# Altium schematic sheet snesslot.SchDoc: SD2SNES
size C; DrawnBy: Gargan; Revision: I; SheetNumber: 2; SheetTotal: 6
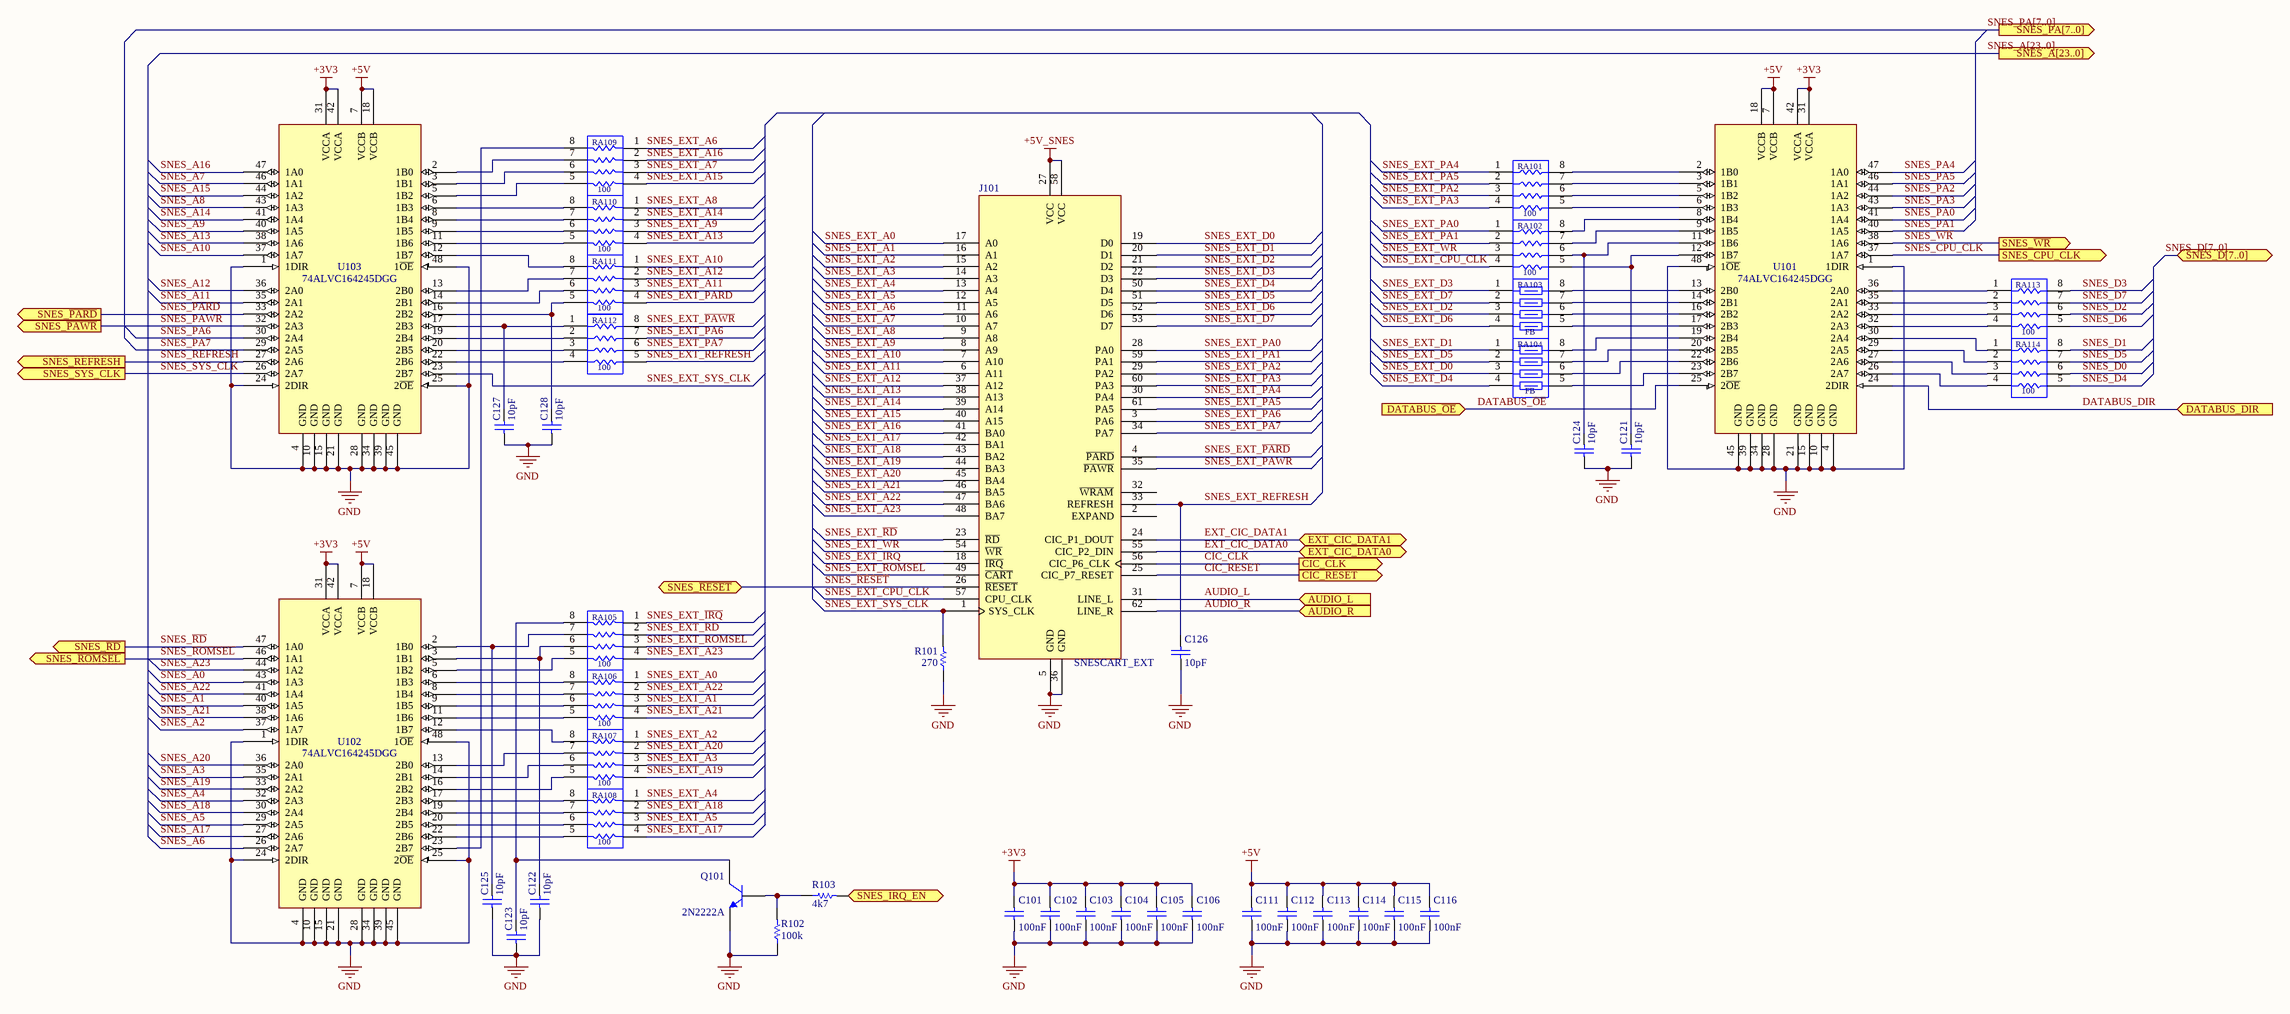
[diagram p0: snesslot.SchDoc]

## Parts
C101  100nF  [SM0805]
C102  100nF  [SM0805]
C103  100nF  [SM0805]
C104  100nF  [SM0805]
C105  100nF  [SM0805]
C106  100nF  [SM0805]
C111  100nF  [SM0805]
C112  100nF  [SM0805]
C113  100nF  [SM0805]
C114  100nF  [SM0805]
C115  100nF  [SM0805]
C116  100nF  [SM0805]
C121  10pF  [SM0805]
C122  10pF  [SM0805]
C123  10pF  [SM0805]
C124  10pF  [SM0805]
C125  10pF  [SM0805]
C126  10pF  [SM0805]
C127  10pF  [SM0805]
C128  10pF  [SM0805]
J101  SNESCART_EXT  [SNESCART_EDGE_CONN]
Q101  2N2222A  [SOT23EBC]
R101  270  [SM0805]
R102  100k  [SM0805]
R103  4k7  [SM0805]
RA101  100  [R_PACK_1206_2]
RA102  100  [R_PACK_1206_2]
RA103  FB  [R_PACK_1206_2]
RA104  FB  [R_PACK_1206_2]
RA105  100  [R_PACK_1206_2]
RA106  100  [R_PACK_1206_2]
RA107  100  [R_PACK_1206_2]
RA108  100  [R_PACK_1206_2]
RA109  100  [R_PACK_1206_2]
RA110  100  [R_PACK_1206_2]
RA111  100  [R_PACK_1206_2]
RA112  100  [R_PACK_1206_2]
RA113  100  [R_PACK_1206_2]
RA114  100  [R_PACK_1206_2]
U101  74ALVC164245DGG  [TSSOP48]
U102  74ALVC164245DGG  [TSSOP48]
U103  74ALVC164245DGG  [TSSOP48]

## Ports
AUDIO_L (in), AUDIO_R (in), CIC_CLK (out), CIC_RESET (out), DATABUS_DIR (in), DATABUS_~{OE} (in), EXT_CIC_DATA0 (bidir), EXT_CIC_DATA1 (bidir), SNES_A[23..0] (out), SNES_CPU_CLK (out), SNES_D[7..0] (bidir), SNES_IRQ_EN (in), SNES_PA[7..0] (out), SNES_REFRESH (out), SNES_SYS_CLK (out), SNES_~{PARD} (out), SNES_~{PAWR} (out), SNES_~{RD} (out), SNES_~{RESET} (bidir), SNES_~{ROMSEL} (out), SNES_~{WR} (out)

## Nets
+3V3: C101.2 C102.2 C103.2 C104.2 C105.2 C106.2 U101.31(VCCA) U101.42(VCCA) U102.31(VCCA) U102.42(VCCA) U103.31(VCCA) U103.42(VCCA)
+5V: C111.2 C112.2 C113.2 C114.2 C115.2 C116.2 U101.7(VCCB) U101.18(VCCB) U102.7(VCCB) U102.18(VCCB) U103.7(VCCB) U103.18(VCCB)
+5V_SNES: J101.27(VCC) J101.58(VCC)
GND: C101.1 C102.1 C103.1 C104.1 C105.1 C106.1 C111.1 C112.1 C113.1 C114.1 C115.1 C116.1 C121.1 C122.1 C123.1 C124.1 C125.1 C126.2 C127.1 C128.1 J101.5(GND) J101.36(GND) Q101.2(E) R101.1 R102.1 U101.1(1DIR) U101.4(GND) U101.10(GND) U101.15(GND) U101.21(GND) U101.28(GND) U101.34(GND) U101.39(GND) U101.45(GND) U101.48(1~{OE}) U102.1(1DIR) U102.4(GND) U102.10(GND) U102.15(GND) U102.21(GND) U102.24(2DIR) U102.25(2~{OE}) U102.28(GND) U102.34(GND) U102.39(GND) U102.45(GND) U102.48(1~{OE}) U103.1(1DIR) U103.4(GND) U103.10(GND) U103.15(GND) U103.21(GND) U103.24(2DIR) U103.25(2~{OE}) U103.28(GND) U103.34(GND) U103.39(GND) U103.45(GND) U103.48(1~{OE})
AUDIO_L: J101.31(LINE_L) ; port AUDIO_L
AUDIO_R: J101.62(LINE_R) ; port AUDIO_R
CIC_CLK: J101.56(CIC_P6_CLK) ; port CIC_CLK
CIC_RESET: J101.25(CIC_P7_RESET) ; port CIC_RESET
DATABUS_DIR: U101.24(2DIR) ; port DATABUS_DIR
DATABUS_~{OE}: U101.25(2~{OE}) ; port DATABUS_~{OE}
EXT_CIC_DATA0: J101.55(CIC_P2_DIN) ; port EXT_CIC_DATA0
EXT_CIC_DATA1: J101.24(CIC_P1_DOUT) ; port EXT_CIC_DATA1
SNES_A0: U102.43(1A3)
SNES_A1: U102.40(1A5)
SNES_A2: U102.37(1A7)
SNES_A3: U102.35(2A1)
SNES_A4: U102.32(2A3)
SNES_A5: U102.29(2A5)
SNES_A6: U102.26(2A7)
SNES_A7: U103.46(1A1)
SNES_A8: U103.43(1A3)
SNES_A9: U103.40(1A5)
SNES_A10: U103.37(1A7)
SNES_A11: U103.35(2A1)
SNES_A12: U103.36(2A0)
SNES_A13: U103.38(1A6)
SNES_A14: U103.41(1A4)
SNES_A15: U103.44(1A2)
SNES_A16: U103.47(1A0)
SNES_A17: U102.27(2A6)
SNES_A18: U102.30(2A4)
SNES_A19: U102.33(2A2)
SNES_A20: U102.36(2A0)
SNES_A21: U102.38(1A6)
SNES_A22: U102.41(1A4)
SNES_A23: U102.44(1A2)
SNES_CPU_CLK: U101.37(1A7) ; port SNES_CPU_CLK
SNES_D0: RA114.6
SNES_D1: RA114.8
SNES_D2: RA113.6
SNES_D3: RA113.8
SNES_D4: RA114.5
SNES_D5: RA114.7
SNES_D6: RA113.5
SNES_D7: RA113.7
SNES_EXT_A0: J101.17(A0) RA106.1
SNES_EXT_A1: J101.16(A1) RA106.3
SNES_EXT_A2: J101.15(A2) RA107.1
SNES_EXT_A3: J101.14(A3) RA107.3
SNES_EXT_A4: J101.13(A4) RA108.1
SNES_EXT_A5: J101.12(A5) RA108.3
SNES_EXT_A6: J101.11(A6) RA109.1
SNES_EXT_A7: J101.10(A7) RA109.3
SNES_EXT_A8: J101.9(A8) RA110.1
SNES_EXT_A9: J101.8(A9) RA110.3
SNES_EXT_A10: J101.7(A10) RA111.1
SNES_EXT_A11: J101.6(A11) RA111.3
SNES_EXT_A12: J101.37(A12) RA111.2
SNES_EXT_A13: J101.38(A13) RA110.4
SNES_EXT_A14: J101.39(A14) RA110.2
SNES_EXT_A15: J101.40(A15) RA109.4
SNES_EXT_A16: J101.41(BA0) RA109.2
SNES_EXT_A17: J101.42(BA1) RA108.4
SNES_EXT_A18: J101.43(BA2) RA108.2
SNES_EXT_A19: J101.44(BA3) RA107.4
SNES_EXT_A20: J101.45(BA4) RA107.2
SNES_EXT_A21: J101.46(BA5) RA106.4
SNES_EXT_A22: J101.47(BA6) RA106.2
SNES_EXT_A23: J101.48(BA7) RA105.4
SNES_EXT_CPU_CLK: J101.57(CPU_CLK) RA102.4
SNES_EXT_D0: J101.19(D0) RA104.3
SNES_EXT_D1: J101.20(D1) RA104.1
SNES_EXT_D2: J101.21(D2) RA103.3
SNES_EXT_D3: J101.22(D3) RA103.1
SNES_EXT_D4: J101.50(D4) RA104.4
SNES_EXT_D5: J101.51(D5) RA104.2
SNES_EXT_D6: J101.52(D6) RA103.4
SNES_EXT_D7: J101.53(D7) RA103.2
SNES_EXT_~{IRQ}: J101.18(~{IRQ}) RA105.1
SNES_EXT_~{PARD}: J101.4(~{PARD}) RA111.4
SNES_EXT_~{PAWR}: J101.35(~{PAWR}) RA112.8
SNES_EXT_PA0: J101.28(PA0) RA102.1
SNES_EXT_PA1: J101.59(PA1) RA102.2
SNES_EXT_PA2: J101.29(PA2) RA101.3
SNES_EXT_PA3: J101.60(PA3) RA101.4
SNES_EXT_PA4: J101.30(PA4) RA101.1
SNES_EXT_PA5: J101.61(PA5) RA101.2
SNES_EXT_PA6: J101.3(PA6) RA112.7
SNES_EXT_PA7: J101.34(PA7) RA112.6
SNES_EXT_~{RD}: J101.23(~{RD}) RA105.2
SNES_EXT_~{ROMSEL}: J101.49(~{CART}) RA105.3
SNES_EXT_REFRESH: C126.1 J101.33(REFRESH) RA112.5
SNES_EXT_SYS_CLK: J101.1(SYS_CLK) R101.2 U103.23(2B7)
SNES_EXT_~{WR}: J101.54(~{WR}) RA102.3
SNES_IRQ_EN: R103.2 ; port SNES_IRQ_EN
SNES_~{PARD}: U103.33(2A2) ; port SNES_~{PARD}
SNES_~{PAWR}: U103.32(2A3) ; port SNES_~{PAWR}
SNES_PA0: U101.41(1A4)
SNES_PA1: U101.40(1A5)
SNES_PA2: U101.44(1A2)
SNES_PA3: U101.43(1A3)
SNES_PA4: U101.47(1A0)
SNES_PA5: U101.46(1A1)
SNES_PA6: U103.30(2A4)
SNES_PA7: U103.29(2A5)
SNES_~{RD}: U102.47(1A0) ; port SNES_~{RD}
SNES_~{RESET}: J101.26(~{RESET}) ; port SNES_~{RESET}
SNES_~{ROMSEL}: U102.46(1A1) ; port SNES_~{ROMSEL}
SNES_REFRESH: U103.27(2A6) ; port SNES_REFRESH
SNES_SYS_CLK: U103.26(2A7) ; port SNES_SYS_CLK
SNES_~{WR}: U101.38(1A6) ; port SNES_~{WR}
NetC121_2: C121.2 RA102.5 U101.12(1B7)
NetC122_2: C122.2 RA105.6 U102.3(1B1)
NetC123_2: C123.2 Q101.3(C) RA105.8
NetC124_2: C124.2 RA102.6 U101.11(1B6)
NetC125_2: C125.2 RA105.7 U102.2(1B0)
NetC127_2: C127.2 RA112.1 U103.17(2B3)
NetC128_2: C128.2 RA111.5 U103.16(2B2)
NetQ101_1: Q101.1(B) R102.2 R103.1
NetRA101_5: RA101.5 U101.6(1B3)
NetRA101_6: RA101.6 U101.5(1B2)
NetRA101_7: RA101.7 U101.3(1B1)
NetRA101_8: RA101.8 U101.2(1B0)
NetRA102_7: RA102.7 U101.9(1B5)
NetRA102_8: RA102.8 U101.8(1B4)
NetRA103_5: RA103.5 U101.17(2B3)
NetRA103_6: RA103.6 U101.16(2B2)
NetRA103_7: RA103.7 U101.14(2B1)
NetRA103_8: RA103.8 U101.13(2B0)
NetRA104_5: RA104.5 U101.23(2B7)
NetRA104_6: RA104.6 U101.22(2B6)
NetRA104_7: RA104.7 U101.20(2B5)
NetRA104_8: RA104.8 U101.19(2B4)
NetRA105_5: RA105.5 U102.5(1B2)
NetRA106_5: RA106.5 U102.11(1B6)
NetRA106_6: RA106.6 U102.9(1B5)
NetRA106_7: RA106.7 U102.8(1B4)
NetRA106_8: RA106.8 U102.6(1B3)
NetRA107_5: RA107.5 U102.16(2B2)
NetRA107_6: RA107.6 U102.14(2B1)
NetRA107_7: RA107.7 U102.13(2B0)
NetRA107_8: RA107.8 U102.12(1B7)
NetRA108_5: RA108.5 U102.22(2B6)
NetRA108_6: RA108.6 U102.20(2B5)
NetRA108_7: RA108.7 U102.19(2B4)
NetRA108_8: RA108.8 U102.17(2B3)
NetRA109_5: RA109.5 U103.5(1B2)
NetRA109_6: RA109.6 U103.3(1B1)
NetRA109_7: RA109.7 U103.2(1B0)
NetRA109_8: RA109.8 U102.23(2B7)
NetRA110_5: RA110.5 U103.11(1B6)
NetRA110_6: RA110.6 U103.9(1B5)
NetRA110_7: RA110.7 U103.8(1B4)
NetRA110_8: RA110.8 U103.6(1B3)
NetRA111_6: RA111.6 U103.14(2B1)
NetRA111_7: RA111.7 U103.13(2B0)
NetRA111_8: RA111.8 U103.12(1B7)
NetRA112_2: RA112.2 U103.19(2B4)
NetRA112_3: RA112.3 U103.20(2B5)
NetRA112_4: RA112.4 U103.22(2B6)
NetRA113_1: RA113.1 U101.36(2A0)
NetRA113_2: RA113.2 U101.35(2A1)
NetRA113_3: RA113.3 U101.33(2A2)
NetRA113_4: RA113.4 U101.32(2A3)
NetRA114_1: RA114.1 U101.30(2A4)
NetRA114_2: RA114.2 U101.29(2A5)
NetRA114_3: RA114.3 U101.27(2A6)
NetRA114_4: RA114.4 U101.26(2A7)

Not connected (* = marked no-connect by the designer): J101 2(EXPAND) 32(~{WRAM})

## Buses and harness runs
bus SNES_A[23..0] = port SNES_A[23..0]
bus SNES_D[7..0] = port SNES_D[7..0]
bus SNES_PA[7..0] = port SNES_PA[7..0]

## Library data of the parts
C101-C106 C111-C116 C121-C128 = Cap: Capacitor
  C101-C106 C111-C116: Value: 100nF
  C121-C128: Value: 10pF
Q101 = NPN: NPN Transistor
R101-R103 = Res1: Resistor
  R101: Value: 270
  R102: Value: 100k
  R103: Value: 4k7
RA101 RA102 RA105-RA114 = R_PACK4: Four Resistor Array
RA103 RA104 = FB_PACK4: Four Ferrite Bead Array
U101-U103 = 74ALVC164245